# Altium schematic sheet GTI_V5.SchDoc
size C
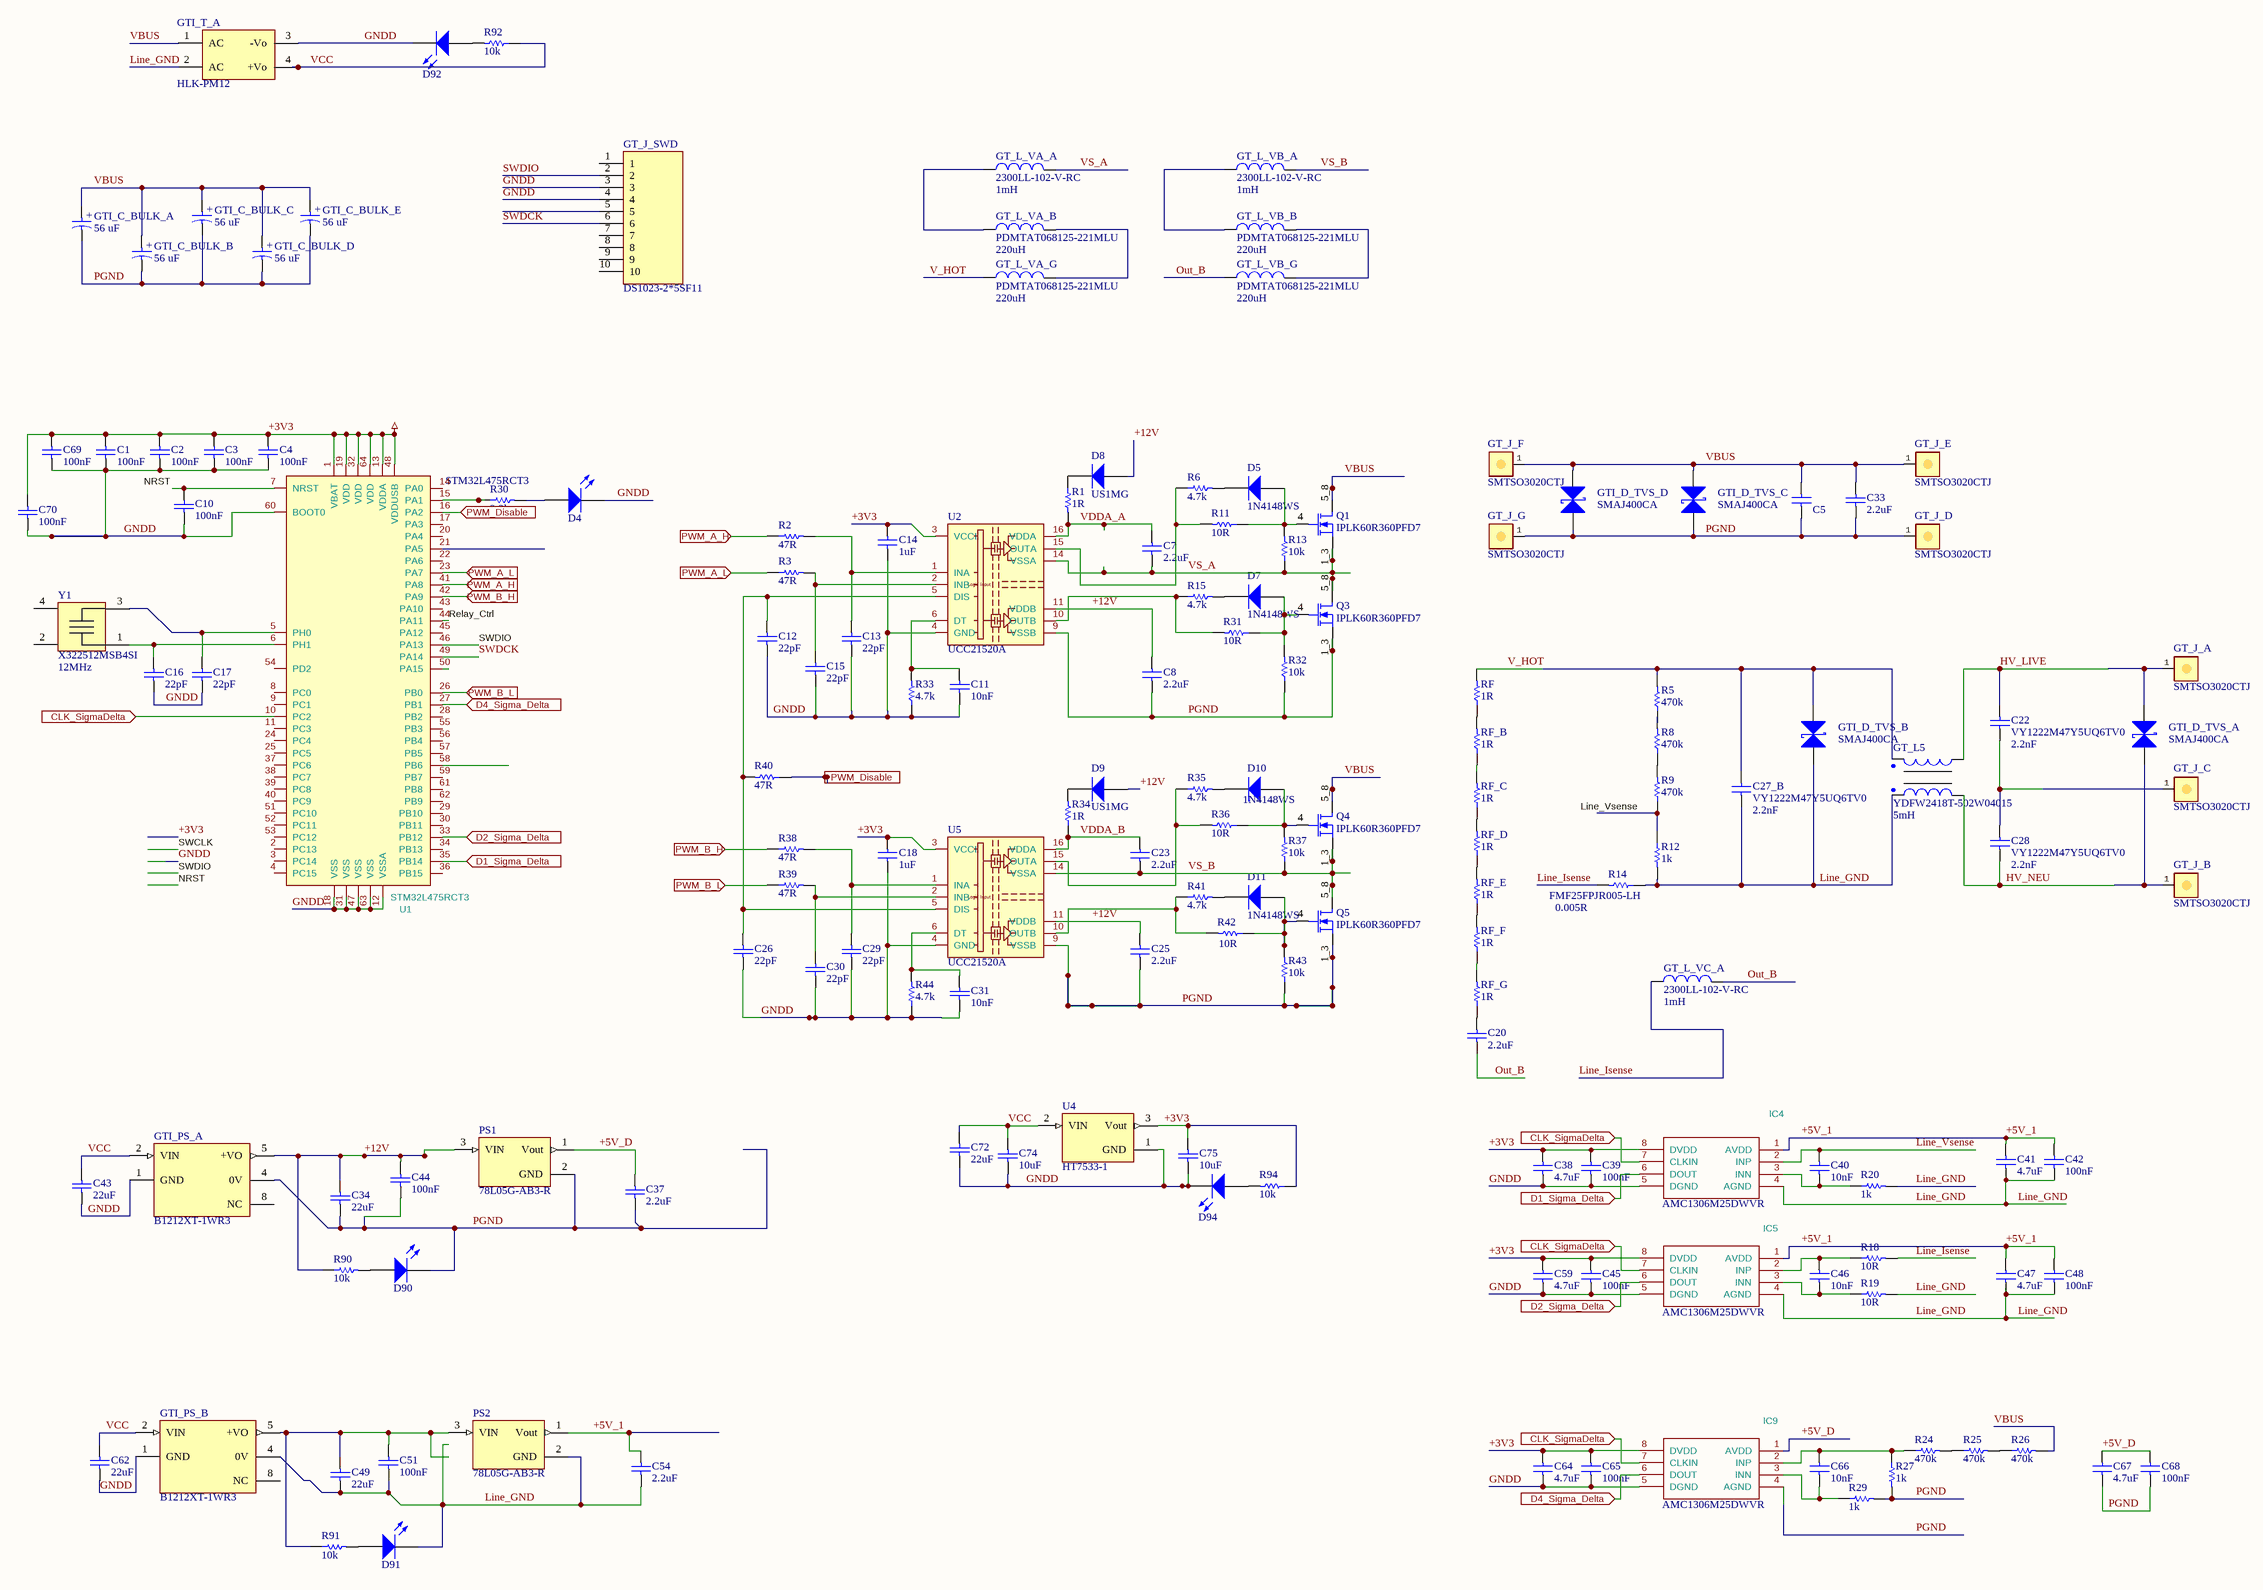
[diagram p0: GTI_V5.SchDoc]

## Parts
C1  value 100nF  [C_0402]  (hidden comment: CL05B104KO5NNNC)
C2  value 100nF  [C_0402]  (hidden comment: CL05B104KO5NNNC)
C3  value 100nF  [C_0402]  (hidden comment: CL05B104KO5NNNC)
C4  value 100nF  [C_0402]  (hidden comment: CL05B104KO5NNNC)
C5  C5750X6S2W225KT000N  [C_2220]  (value not drawn)
C7  value 2.2uF  [C_0603]  (hidden comment: CL10A225KO8NNNC)
C8  value 2.2uF  [C_0603]  (hidden comment: CL10A225KO8NNNC)
C10  value 100nF  [C_0402]  (hidden comment: CL05B104KO5NNNC)
C11  value 10nF  [C_0402]  (hidden comment: CL05B103KB5NNNC)
C12  value 22pF  [C_0402]  (hidden comment: 0402CG220J500NT)
C13  value 22pF  [C_0402]  (hidden comment: 0402CG220J500NT)
C14  value 1uF  [C_0402]  (hidden comment: CL05A105KA5NQNC)
C15  value 22pF  [C_0402]  (hidden comment: 0402CG220J500NT)
C16  value 22pF  [C_0402]  (hidden comment: 0402CG220J500NT)
C17  value 22pF  [C_0402]  (hidden comment: 0402CG220J500NT)
C18  value 1uF  [C_0402]  (hidden comment: CL05A105KA5NQNC)
C20  value 2.2uF  [C_FILM_D27.5]  (hidden comment: KP225J2J2705)
C22  VY1222M47Y5UQ6TV0  value 2.2nF  [C_DISK_D10]
C23  value 2.2uF  [C_0603]  (hidden comment: CL10A225KO8NNNC)
C25  value 2.2uF  [C_0603]  (hidden comment: CL10A225KO8NNNC)
C26  value 22pF  [C_0402]  (hidden comment: 0402CG220J500NT)
C27_B  VY1222M47Y5UQ6TV0  value 2.2nF  [C_DISK_D10]
C28  VY1222M47Y5UQ6TV0  value 2.2nF  [C_DISK_D10]
C29  value 22pF  [C_0402]  (hidden comment: 0402CG220J500NT)
C30  value 22pF  [C_0402]  (hidden comment: 0402CG220J500NT)
C31  value 10nF  [C_0402]  (hidden comment: CL05B103KB5NNNC)
C33  value 2.2uF  [C_FILM_D27.5]  (hidden comment: KP225J2J2705)
C34  value 22uF  [C_1206]  (hidden comment: CL31A226KAHNNNE)
C37  value 2.2uF  [C_0603]  (hidden comment: CL10A225KO8NNNC)
C38  value 4.7uF  [C_0402]  (hidden comment: CL05A475MP5NRNC)
C39  value 100nF  [C_0402]  (hidden comment: CL05B104KO5NNNC)
C40  value 10nF  [C_0402]  (hidden comment: CL05B103KB5NNNC)
C41  value 4.7uF  [C_0402]  (hidden comment: CL05A475MP5NRNC)
C42  value 100nF  [C_0402]  (hidden comment: CL05B104KO5NNNC)
C43  value 22uF  [C_1206]  (hidden comment: CL31A226KAHNNNE)
C44  value 100nF  [C_0603]  (hidden comment: CC0603KRX7R9BB104)
C45  value 100nF  [C_0402]  (hidden comment: CL05B104KO5NNNC)
C46  value 10nF  [C_0402]  (hidden comment: CL05B103KB5NNNC)
C47  value 4.7uF  [C_0402]  (hidden comment: CL05A475MP5NRNC)
C48  value 100nF  [C_0402]  (hidden comment: CL05B104KO5NNNC)
C49  value 22uF  [C_1206]  (hidden comment: CL31A226KAHNNNE)
C51  value 100nF  [C_0603]  (hidden comment: CC0603KRX7R9BB104)
C54  value 2.2uF  [C_0603]  (hidden comment: CL10A225KO8NNNC)
C59  value 4.7uF  [C_0402]  (hidden comment: CL05A475MP5NRNC)
C62  value 22uF  [C_1206]  (hidden comment: CL31A226KAHNNNE)
C64  value 4.7uF  [C_0402]  (hidden comment: CL05A475MP5NRNC)
C65  value 100nF  [C_0402]  (hidden comment: CL05B104KO5NNNC)
C66  value 10nF  [C_0402]  (hidden comment: CL05B103KB5NNNC)
C67  value 4.7uF  [C_0402]  (hidden comment: CL05A475MP5NRNC)
C68  value 100nF  [C_0402]  (hidden comment: CL05B104KO5NNNC)
C69  value 100nF  [C_0402]  (hidden comment: CL05B104KO5NNNC)
C70  value 100nF  [C_0402]  (hidden comment: CL05B104KO5NNNC)
C72  value 22uF  [C_1206]  (hidden comment: CL31A226KAHNNNE)
C74  value 10uF  [C_0603]  (hidden comment: CL10A106MA8NRNC)
C75  value 10uF  [C_0603]  (hidden comment: CL10A106MA8NRNC)
D4  KT-0603R  [D_0603]  (value not drawn)
D5  1N4148WS  [SOD-323]
D7  1N4148WS  [SOD-323]
D8  US1MG  [DO-214AC]
D9  US1MG  [DO-214AC]
D10  1N4148WS  [SOD-323]
D11  1N4148WS  [SOD-323]
D90  KT-0603R  [D_0603]  (value not drawn)
D91  KT-0603R  [D_0603]  (value not drawn)
D92  KT-0603R  [D_0603]  (value not drawn)
D94  KT-0603R  [D_0603]  (value not drawn)
GT_J_A  SMTSO3020CTJ  [SMTSO3020CTJ]
GT_J_B  SMTSO3020CTJ  [SMTSO3020CTJ]
GT_J_C  SMTSO3020CTJ  [SMTSO3020CTJ]
GT_J_D  SMTSO3020CTJ  [SMTSO3020CTJ]
GT_J_E  SMTSO3020CTJ  [SMTSO3020CTJ]
GT_J_F  SMTSO3020CTJ  [SMTSO3020CTJ]
GT_J_G  SMTSO3020CTJ  [SMTSO3020CTJ]
GT_J_SWD  DS1023-2*5SF11  [HDR_FEM_2X5P]
GT_L5  YDFW2418T-502W04015  value 5mH  [YDFW2418T-103W03015]
GT_L_VA_A  2300LL-102-V-RC  value 1mH  [IND_2300LL-102-V-RC]
GT_L_VA_B  PDMTAT068125-221MLU  value 220uH  [L_TOROID_8MM_D]
GT_L_VA_G  PDMTAT068125-221MLU  value 220uH  [L_TOROID_8MM_D]
GT_L_VB_A  2300LL-102-V-RC  value 1mH  [IND_2300LL-102-V-RC]
GT_L_VB_B  PDMTAT068125-221MLU  value 220uH  [L_TOROID_8MM_D]
GT_L_VB_G  PDMTAT068125-221MLU  value 220uH  [L_TOROID_8MM_D]
GT_L_VC_A  2300LL-102-V-RC  value 1mH  [IND_2300LL-102-V-RC]
GTI_C_BULK_A  56 uF  [CAP_D18_L7.5]
GTI_C_BULK_B  56 uF  [CAP_D18_L7.5]
GTI_C_BULK_C  56 uF  [CAP_D18_L7.5]
GTI_C_BULK_D  56 uF  [CAP_D18_L7.5]
GTI_C_BULK_E  56 uF  [CAP_D18_L7.5]
GTI_D_TVS_A  SMAJ400CA  [DO-214AC]
GTI_D_TVS_B  SMAJ400CA  [DO-214AC]
GTI_D_TVS_C  SMAJ400CA  [DO-214AC]
GTI_D_TVS_D  SMAJ400CA  [DO-214AC]
GTI_PS_A  B1212XT-1WR3  [CONV_B0512XT-1WR3]
GTI_PS_B  B1212XT-1WR3  [CONV_B0512XT-1WR3]
GTI_T_A  HLK-PM12  [HLK-PM12]
IC4  AMC1306M25DWVR  [SOIC-8-P1.27-W7.5]
IC5  AMC1306M25DWVR  [SOIC-8-P1.27-W7.5]
IC9  AMC1306M25DWVR  [SOIC-8-P1.27-W7.5]
PS1  78L05G-AB3-R  [SOT-223-3]
PS2  78L05G-AB3-R  [SOT-223-3]
Q1  IPLK60R360PFD7  [SO-8FL]
Q3  IPLK60R360PFD7  [SO-8FL]
Q4  IPLK60R360PFD7  [SO-8FL]
Q5  IPLK60R360PFD7  [SO-8FL]
R1  value 1R  [R_0603]  (hidden comment: 0603WAF100KT5E)
R2  value 47R  [R_0402]  (hidden comment: 0402WGF470JTCE)
R3  value 47R  [R_0402]  (hidden comment: 0402WGF470JTCE)
R5  value 470k  [R_0805]  (hidden comment: 0805W8F4703T5E)
R6  value 4.7k  [R_0402]  (hidden comment: 0402WGF4701TCE)
R8  value 470k  [R_0805]  (hidden comment: 0805W8F4703T5E)
R9  value 470k  [R_0805]  (hidden comment: 0805W8F4703T5E)
R11  value 10R  [R_0603]  (hidden comment: 0603WAF100JT5E)
R12  value 1k  [R_0402]  (hidden comment: 0402WGF1001TCE)
R13  value 10k  [R_0402]  (hidden comment: 0402WGF1002TCE)
R14  FMF25FPJR005-LH  value 0.005R  [R_2512]
R15  value 4.7k  [R_0402]  (hidden comment: 0402WGF4701TCE)
R18  value 10R  [R_0402]  (hidden comment: 0402WGF100JTCE)
R19  value 10R  [R_0402]  (hidden comment: 0402WGF100JTCE)
R20  value 1k  [R_0402]  (hidden comment: 0402WGF1001TCE)
R24  value 470k  [R_0805]  (hidden comment: 0805W8F4703T5E)
R25  value 470k  [R_0805]  (hidden comment: 0805W8F4703T5E)
R26  value 470k  [R_0805]  (hidden comment: 0805W8F4703T5E)
R27  value 1k  [R_0402]  (hidden comment: 0402WGF1001TCE)
R29  value 1k  [R_0402]  (hidden comment: 0402WGF1001TCE)
R30  value 2.2k  [R_0402]  (hidden comment: 0402WGF2201TCE)
R31  value 10R  [R_0603]  (hidden comment: 0603WAF100JT5E)
R32  value 10k  [R_0402]  (hidden comment: 0402WGF1002TCE)
R33  value 4.7k  [R_0402]  (hidden comment: 0402WGF4701TCE)
R34  value 1R  [R_0603]  (hidden comment: 0603WAF100KT5E)
R35  value 4.7k  [R_0402]  (hidden comment: 0402WGF4701TCE)
R36  value 10R  [R_0603]  (hidden comment: 0603WAF100JT5E)
R37  value 10k  [R_0402]  (hidden comment: 0402WGF1002TCE)
R38  value 47R  [R_0402]  (hidden comment: 0402WGF470JTCE)
R39  value 47R  [R_0402]  (hidden comment: 0402WGF470JTCE)
R40  value 47R  [R_0402]  (hidden comment: 0402WGF470JTCE)
R41  value 4.7k  [R_0402]  (hidden comment: 0402WGF4701TCE)
R42  value 10R  [R_0603]  (hidden comment: 0603WAF100JT5E)
R43  value 10k  [R_0402]  (hidden comment: 0402WGF1002TCE)
R44  value 4.7k  [R_0402]  (hidden comment: 0402WGF4701TCE)
R90  value 10k  [R_0402]  (hidden comment: 0402WGF1002TCE)
R91  value 10k  [R_0402]  (hidden comment: 0402WGF1002TCE)
R92  value 10k  [R_0402]  (hidden comment: 0402WGF1002TCE)
R94  value 10k  [R_0402]  (hidden comment: 0402WGF1002TCE)
RF  value 1R  [R_1206]  (hidden comment: 1206W4F1000T5E)
RF_B  value 1R  [R_1206]  (hidden comment: 1206W4F1000T5E)
RF_C  value 1R  [R_1206]  (hidden comment: 1206W4F1000T5E)
RF_D  value 1R  [R_1206]  (hidden comment: 1206W4F1000T5E)
RF_E  value 1R  [R_1206]  (hidden comment: 1206W4F1000T5E)
RF_F  value 1R  [R_1206]  (hidden comment: 1206W4F1000T5E)
RF_G  value 1R  [R_1206]  (hidden comment: 1206W4F1000T5E)
U1  STM32L475RCT3  [QFP-64-P0.5MM]
U2  UCC21520A  [SOIC-16-P1.27-W7.5]
U4  HT7533-1  [SOT-223-3]
U5  UCC21520A  [SOIC-16-P1.27-W7.5]
Y1  X322512MSB4SI  value 12MHz  [X322512MSB4SI]

## Ports
CLK_SigmaDelta (in), D1_Sigma_Delta (in), D2_Sigma_Delta (in), D4_Sigma_Delta (in), PWM_A_H (in), PWM_A_L (in), PWM_B_H (in), PWM_B_L (in), PWM_Disable (in)

## Nets
+3V3: C1.1 C2.1 C3.1 C4.1 C14.2 C18.2 C38.1 C39.1 C45.1 C59.1 C64.1 C65.1 C69.1 C70.1 C75.1 IC4.8(DVDD) IC5.8(DVDD) IC9.8(DVDD) R94.1 U1.1(VBAT) U1.13(VDDA) U1.19(VDD) U1.32(VDD) U1.48(VDDUSB) U1.64(VDD) U2.3(VCCI) U4.3(Vout) U5.3(VCCI)
+5V_1: C41.1 C42.1 C47.1 C48.1 C54.1 IC4.1(AVDD) IC5.1(AVDD) PS2.1(Vout)
+5V_D: C37.1 C67.1 C68.1 IC9.1(AVDD) PS1.1(Vout)
+12V: C8.2 C25.2 C34.1 C44.1 D8.2(A) D9.2(A) GTI_PS_A.5(+VO) PS1.3(VIN) R90.1 U2.11(VDDB) U5.11(VDDB)
CLK_SigmaDelta: IC4.7(CLKIN) IC5.7(CLKIN) IC9.7(CLKIN) U1.10(PC2) ; port CLK_SigmaDelta
D1_Sigma_Delta: IC4.6(DOUT) U1.35(PB14) ; port D1_Sigma_Delta
D2_Sigma_Delta: IC5.6(DOUT) U1.33(PB12) ; port D2_Sigma_Delta
D4_Sigma_Delta: IC9.6(DOUT) U1.27(PB1) ; port D4_Sigma_Delta
GNDD: C1.2 C2.2 C3.2 C4.2 C10.2 C11.1 C12.2 C13.2 C14.1 C15.2 C16.2 C17.2 C18.1 C26.2 C29.2 C30.2 C31.1 C38.2 C39.2 C43.2 C45.2 C59.2 C62.2 C64.2 C65.2 C69.2 C70.2 C72.2 C74.2 C75.2 D4.1(K) D92.1(K) D94.1(K) GT_J_SWD.3 GT_J_SWD.4 GTI_PS_A.1(GND) GTI_PS_B.1(GND) GTI_T_A.3(-Vo) IC4.5(DGND) IC5.5(DGND) IC9.5(DGND) R33.1 R44.1 U1.12(VSSA) U1.18(VSS) U1.31(VSS) U1.47(VSS) U1.60(BOOT0) U1.63(VSS) U2.4(GND) U4.1(GND) U5.4(GND)
HV_LIVE: C22.2 GT_J_A.1 GT_L5.4 GTI_D_TVS_A.1(K)
HV_NEU: C28.1 GT_J_B.1 GT_L5.3 GTI_D_TVS_A.2(A)
Line_GND: C27_B.1 C41.2 C42.2 C47.2 C48.2 C49.2 C51.2 C54.2 D91.1(K) GT_L5.2 GTI_D_TVS_B.2(A) GTI_PS_B.4(0V) GTI_T_A.2(AC) IC4.4(AGND) IC5.4(AGND) PS2.2(GND) R12.2 R14.1 R19.2 R20.2
Line_Isense: GT_L_VC_A.1 R14.2 R18.2
Line_Vsense: C40.1 IC4.2(INP) R9.1 R12.1
NRST: C10.1 U1.7(NRST)
Out_B: C20.1 GT_L_VB_G.1 GT_L_VC_A.2
PGND: C5.2 C8.1 C25.1 C33.1 C34.2 C37.2 C44.2 C67.2 C68.2 D90.1(K) GT_J_D.1 GT_J_G.1 GTI_C_BULK_A.1 GTI_C_BULK_B.1 GTI_C_BULK_C.1 GTI_C_BULK_D.1 GTI_C_BULK_E.1 GTI_D_TVS_C.2(A) GTI_D_TVS_D.2(A) GTI_PS_A.4(0V) IC9.4(AGND) PS1.2(GND) Q3.1_3(S) Q5.1_3(S) R27.2 R29.2 R32.1 R43.1 U2.9(VSSB) U5.9(VSSB)
PWM_A_H: R2.1 U1.41(PA8) ; port PWM_A_H
PWM_A_L: R3.1 U1.23(PA7) ; port PWM_A_L
PWM_B_H: R38.1 U1.42(PA9) ; port PWM_B_H
PWM_B_L: R39.1 U1.26(PB0) ; port PWM_B_L
PWM_Disable: R40.1 U1.16(PA2) ; port PWM_Disable
Relay_Ctrl: U1.44(PA11)
SWDCK: GT_J_SWD.6 U1.49(PA14)
SWDIO: GT_J_SWD.2 U1.46(PA13)
V_HOT: C27_B.2 GT_L5.1 GT_L_VA_G.1 GTI_D_TVS_B.1(K) R5.2 RF.2
VBUS: C5.1 C33.2 GT_J_E.1 GT_J_F.1 GTI_C_BULK_A.2 GTI_C_BULK_B.2 GTI_C_BULK_C.2 GTI_C_BULK_D.2 GTI_C_BULK_E.2 GTI_D_TVS_C.1(K) GTI_D_TVS_D.1(K) GTI_T_A.1(AC) Q1.5_8(D) Q4.5_8(D) R26.2
VCC: C43.1 C62.1 C72.1 C74.1 GTI_PS_A.2(VIN) GTI_PS_B.2(VIN) GTI_T_A.4(+Vo) R92.1 U4.2(VIN)
VDDA_A: C7.2 R1.2 U2.16(VDDA)
VDDA_B: C23.2 R34.1 U5.16(VDDA)
VS_A: C7.1 GT_L_VA_A.2 Q1.1_3(S) Q3.5_8(D) R13.1 U2.14(VSSA)
VS_B: C23.1 GT_L_VB_A.2 Q4.1_3(S) Q5.5_8(D) R37.1 U5.14(VSSA)
NetC11_2: C11.2 R33.2 U2.6(DT)
NetC12_1: C12.1 C26.1 R40.2 U2.5(DIS) U5.5(DIS)
NetC13_1: C13.1 R2.2 U2.1(INA)
NetC15_1: C15.1 R3.2 U2.2(INB)
NetC16_1: C16.1 U1.6(PH1) Y1.1
NetC17_1: C17.1 U1.5(PH0) Y1.3
NetC20_2: C20.2 RF_G.1
NetC22_1: C22.1 C28.2 GT_J_C.1
NetC29_1: C29.1 R38.2 U5.1(INA)
NetC30_1: C30.1 R39.2 U5.2(INB)
NetC31_2: C31.2 R44.2 U5.6(DT)
NetC40_2: C40.2 IC4.3(INN) R20.1
NetC46_1: C46.1 IC5.2(INP) R18.1
NetC46_2: C46.2 IC5.3(INN) R19.1
NetC49_1: C49.1 C51.1 GTI_PS_B.5(+VO) PS2.3(VIN) R91.1
NetC66_1: C66.1 IC9.2(INP) R24.1 R27.1
NetC66_2: C66.2 IC9.3(INN) R29.1
NetD4_2: D4.2(A) R30.2
NetD5_1: D5.1(K) R6.2
NetD5_2: D5.2(A) Q1.4(G) R11.1 R13.2
NetD7_1: D7.1(K) R15.2
NetD7_2: D7.2(A) Q3.4(G) R31.1 R32.2
NetD8_1: D8.1(K) R1.1
NetD9_1: D9.1(K) R34.2
NetD10_1: D10.1(K) R35.2
NetD10_2: D10.2(A) Q4.4(G) R36.1 R37.2
NetD11_1: D11.1(K) R41.2
NetD11_2: D11.2(A) Q5.4(G) R42.1 R43.2
NetD90_2: D90.2(A) R90.2
NetD91_2: D91.2(A) R91.2
NetD92_2: D92.2(A) R92.2
NetD94_2: D94.2(A) R94.2
NetGT_L_VA_A_1: GT_L_VA_A.1 GT_L_VA_B.1
NetGT_L_VA_B_2: GT_L_VA_B.2 GT_L_VA_G.2
NetGT_L_VB_A_1: GT_L_VB_A.1 GT_L_VB_B.1
NetGT_L_VB_B_2: GT_L_VB_B.2 GT_L_VB_G.2
NetR5_1: R5.1 R8.2
NetR6_1: R6.1 R11.2 U2.15(OUTA)
NetR8_1: R8.1 R9.2
NetR15_1: R15.1 R31.2 U2.10(OUTB)
NetR24_2: R24.2 R25.1
NetR25_2: R25.2 R26.1
NetR30_1: R30.1 U1.15(PA1)
NetR35_1: R35.1 R36.2 U5.15(OUTA)
NetR41_1: R41.1 R42.2 U5.10(OUTB)
NetRF_1: RF.1 RF_B.2
NetRF_B_1: RF_B.1 RF_C.2
NetRF_C_1: RF_C.1 RF_D.2
NetRF_D_1: RF_D.1 RF_E.2
NetRF_E_1: RF_E.1 RF_F.2
NetRF_F_1: RF_F.1 RF_G.2

Not connected (* = marked no-connect by the designer): GT_J_SWD 1 5 7 8 9 10; GTI_PS_A 8(NC); GTI_PS_B 8(NC); U1 2(PC13) 3(PC14) 4(PC15) 8(PC0) 9(PC1) 11(PC3) 14(PA0) 17(PA3) 20(PA4) 21(PA5) 22(PA6) 24(PC4) 25(PC5) 28(PB2) 29(PB10) 30(PB11) 34(PB13) 36(PB15) 37(PC6) 38(PC7) 39(PC8) 40(PC9) 43(PA10) 45(PA12) 50(PA15) 51(PC10) 52(PC11) 53(PC12) 54(PD2) 55(PB3) 56(PB4) 57(PB5) 58(PB6) 59(PB7) 61(PB8) 62(PB9); Y1 2(GND) 4(GND)

## Notes on the sheet
- Title
- Size:
- Date:
- File:
- C
- Number:
- Time:
- Revision:
- Sheet
- of
- (in symbol EGW2WM560M25OT) +
- (in symbol UCC21520A) Logic Input

## Library data of the parts
C1-C4 C10 C39 C42 C45 C48 C65 C68-C70 = CL05B104KO5NNNC: C - CAPACITOR - MLCC - 100nF - 16V - 0402; WVDC: 16; LCSC Part #: C1525; JLC Availability: Basic
C5 = C5750X6S2W225KT000N: C - CAPACITOR - MLCC - 2.2uF - 450V - 2020; LCSC Part #: C445674; JLC Availability: Extended
C7 C8 C23 C25 C37 C54 = CL10A225KO8NNNC: C - CAPACITOR - MLCC - 2.2uF - 16V - 0603; WVDC: 16; LCSC Part #: C23630; JLC Availability: Basic
C11 C31 C40 C46 C66 = CL05B103KB5NNNC: C - CAPACITOR - MLCC - 10nF - 50V - 0402; WVDC: 50; LCSC Part #: C15195; JLC Availability: Basic
C12 C13 C15-C17 C26 C29 C30 = 0402CG220J500NT: C - CAPACITOR - MLCC - 22pF - 50V - 0402; WVDC: 50; LCSC Part #: C1555; JLC Availability: Basic
C14 C18 = CL05A105KA5NQNC: C - CAPACITOR - MLCC - 1uF - 25V - 0402; WVDC: 16; LCSC Part #: C52923; JLC Availability: Basic
C20 C33 = KP225J2J2705: C - CAPACITOR - FILM - 2.2uF - 630V - 10mm Plugin; WVDC: 630V; LCSC Part #: C5371183; JLC Availability: Extended
C22 C27_B C28 = VY1222M47Y5UQ6TV0: C - CAPACITOR - X/Y - 2.2nF - 1.5kV - 10mm Plugin; WVDC: 1.5kV; LCSC Part #: C499511; JLC Availability: Extended
C34 C43 C49 C62 C72 = CL31A226KAHNNNE: C - CAPACITOR - MLCC - 22uF - 25V - 1206; WVDC: 25V; LCSC Part #: C12891; JLC Availability: Basic
C38 C41 C47 C59 C64 C67 = CL05A475MP5NRNC: C - CAPACITOR - MLCC - 4.7uF - 10V - 0402; WVDC: 10; LCSC Part #: C23733; JLC Availability: Basic
C44 C51 = CC0603KRX7R9BB104: C - CAPACITOR - MLCC - 100nF - 50V - 0603; WVDC: 50; LCSC Part #: C14663; JLC Availability: Basic
C74 C75 = CL10A106MA8NRNC: C - CAPACITOR - MLCC - 10uF - 25V - 0603; WVDC: 25; LCSC Part #: C96446; Availability: Basic
D4 D90-D92 D94 = KT-0603R: D - LED - 0603 - Red; LCSC Part #: C2286; JLC Availability: Basic
D5 D7 D10 D11 = 1N4148WS: D - DIODE - FAST TRR - 100V - 150mA - 4ns; LCSC Part #: C2128; JLC Availability: Basic; PIV: 100V; If: 150mA; Trr: 4ns
D8 D9 = US1MG: D - DIODE - FAST TRR - 1KV - 1A; LCSC Part #: C412437; JLC Availability: Basic
GT_J_A GT_J_B GT_J_C GT_J_D GT_J_E GT_J_F GT_J_G = SMTSO3020CTJ: J - PCB NUT - M3 x 2; LCSC Part #: C2916381; JLC Availability: Extended
GT_J_SWD = DS1023-2*5SF11: J - JACK - PIN_HEADER 2X5P; LCSC Part #: C92270; JLC Availability: Extended
GT_L5 = YDFW2418T-502W04015: L - CM CHOKE - 5mH; Datasheet: https://datasheet.lcsc.com/lcsc/2310091405_YJYCOIN-YDFW2418T-103W03015_C5563765.pdf; LCSC Part #: C5563765; JLC Availability: Extended
GT_L_VA_A GT_L_VB_A GT_L_VC_A = 2300LL-102-V-RC: L - INDUCTOR - 1mH - 3.5A - TOROID; Isat: 3.7A; LCSC Part #: C17539870; JLC Availability: Extended
GT_L_VA_B GT_L_VA_G GT_L_VB_B GT_L_VB_G = PDMTAT068125-221MLU: L - INDUCTOR - 220uH - 5A - 23mm; Isat: 5A; LCSC Part #: C3011545; JLC Availability: Extended
GTI_C_BULK_A GTI_C_BULK_B GTI_C_BULK_C GTI_C_BULK_D GTI_C_BULK_E = EGW2WM560M25OT: C - CAPACITOR - ELECTROYLTIC - 56 uF - 450V - TH; MANUFACTURER: AISHI (AIHUA) GROUP; LCSC PART #: C2902571; Availability: Extended
GTI_D_TVS_A GTI_D_TVS_B GTI_D_TVS_C GTI_D_TVS_D = SMAJ400CA: D - DIODE - TVS - 400V - 0.7A; Vrrm: 400; If: 0.7A; LCSC Part #: C132232; JLC Availability: Extended
GTI_PS_A GTI_PS_B = B1212XT-1WR3: T - Isolated Module DC DC Converter 12 -> 12V 84mA - DIP; MF: MORNSUN; LCSC Part #: C2684910; Value: *; MP: B1212XT-1WR3
GTI_T_A = HLK-PM12: T - 12V - 0.25A - OFF LINE PSU; MF: HI-LINK; Package: DIP; Value: 12V; LCSC Part #: C209905; MP: HLK-PM12; Availability: Extended
IC4 IC5 IC9 = AMC1306M25DWVR: U - IC - SPECIALIZED ADC; Manufacturer_Name: Texas Instruments; Value: AMC1306M25QDWVRQ1; Footprint: AMC1306:SOIC127P1150X280-8N; Datasheet: https://www.ti.com/lit/ds/symlink/amc1306m25-q1.pdf?ts=1669687288430&ref_url=https%253A%252F%252Fwww.ti.com%252Fproduct%252Fja-jp%252FAMC1306M25-Q1; Height: 2.8; Mouser Part Number: 595-MC1306M25QDWVRQ1; Mouser Price/Stock: https://www.mouser.co.uk/ProductDetail/Texas-Instruments/AMC1306M25QDWVRQ1?qs=t7xnP681wgWXZUIusdWe2w%3D%3D; Manufacturer_Part_Number: AMC1306M25QDWVRQ1; LCSC Part #: C471874
PS1 PS2 = 78L05G-AB3-R: U - IC - 5V Power Regulator; VOut: 5.0; LCSC Part #: C71136; JLC Availability: Basic
Q1 Q3-Q5 = IPLK60R360PFD7: Q - TRANSISTOR - MOSFET (N) - 600V - 303m - 13A; WVDC: 600; JLC Availability: Basic; LCSC Part #: C537054
R1 R34 = 0603WAF100KT5E: R - RESISTOR - SMD - 1R - 1% -  0603; LCSC Part #: C22936; JLC Availability: Basic
R2 R3 R38-R40 = 0402WGF470JTCE: R - RESISTOR - SMD - 47R - 1% - 0402; LCSC Part #: C25118; JLC Availability: Basic
R5 R8 R9 R24-R26 = 0805W8F4703T5E: R - RESISTOR - SMD - 470k - 1% - 0805; LCSC Part #: C17709; JLC Availability: Basic
R6 R15 R33 R35 R41 R44 = 0402WGF4701TCE: R - RESISTOR - SMD - 4.7k - 1% - 0402; LCSC Part #: C25900; JLC Availability: Basic
R11 R31 R36 R42 = 0603WAF100JT5E: R - RESISTOR - SMD - 10R - 1% - 0603; LCSC Part #: C22859; JLC Availability: Basic
R12 R20 R27 R29 = 0402WGF1001TCE: R - RESISTOR - SMD - 1k - 1% - 0402; LCSC Part #: C11702; JLC Availability: Basic
R13 R32 R37 R43 R90-R92 R94 = 0402WGF1002TCE: R - RESISTOR - SMD - 10k - 1% - 0402; LCSC Part #: C25744; JLC Availability: Basic
R14 = FMF25FPJR005-LH: R - RESISTOR - SMD - 0.005R - 1% - 2512 - 2W; ComponentLink1URL: http://riedon.com/media/pdf/CSR.pdf; ComponentLink1Description: http://riedon.com/media/pdf/CSR.pdf; LCSC Part #: C371096; JLC Availability: Extended
R18 R19 = 0402WGF100JTCE: R - RESISTOR - SMD - 10R - 1% - 0402; LCSC Part #: C25077; JLC Availability: Basic
R30 = 0402WGF2201TCE: R - RESISTOR - SMD - 2.2k - 1% - 0402; LCSC Part #: C25879; JLC Availability: Basic
RF RF_B RF_C RF_D RF_E RF_F RF_G = 1206W4F1000T5E: R - RESISTOR - SMD - 1R - 1% - 1206; LCSC Part #: C17928; JLC Availability: Basic
U1 = STM32L475RCT3: U - IC - MCU 32BIT LOW POWER 64LQFP; Value: STM32L475RCT3; Datasheet: http://www.st.com/st-web-ui/static/active/en/resource/technical/document/datasheet/DM00172872.pdf; LCSC Part #: C1235405
U2 U5 = UCC21520A: U - IC - GATE DRIVER, Half Bridge, Isolated; LCSC Part #: C601651; JLC Availability: Extended
U4 = HT7533-1: U - IC - 3V3 Power Regulator; VOut: 3.3; LCSC Part #: C14289; JLC Availability: Basic
Y1 = X322512MSB4SI: Y - RESONATOR - 12MHZ ±10PPM; LCSC Part #: C9002; JLC Availability: Basic